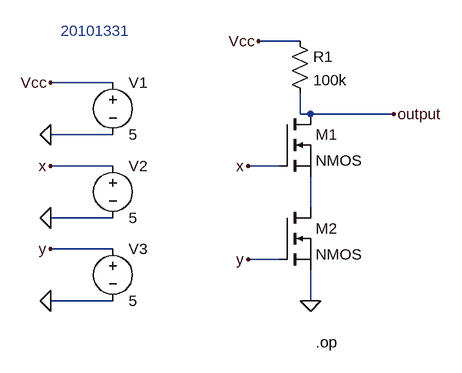
[diagram p0: schematic NAND.asc]
NAND.asc, the LTspice schematic file:
Version 4
SHEET 1 880 680
WIRE 176 -32 112 -32
WIRE -112 32 -208 32
WIRE 176 80 176 48
WIRE 192 80 176 80
WIRE 320 80 192 80
WIRE -112 112 -208 112
WIRE -112 160 -208 160
WIRE 144 160 96 160
WIRE 192 224 192 176
WIRE -112 240 -208 240
WIRE -112 288 -208 288
WIRE 144 304 96 304
WIRE -112 368 -208 368
WIRE 192 368 192 320
FLAG 192 368 0
FLAG 112 -32 Vcc
FLAG 96 160 x
FLAG 96 304 y
FLAG -208 112 0
FLAG -208 240 0
FLAG -208 368 0
FLAG -208 32 Vcc
FLAG -208 160 x
FLAG -208 288 y
FLAG 320 80 output
SYMBOL nmos 144 80 R0
SYMATTR InstName M1
SYMBOL nmos 144 224 R0
SYMATTR InstName M2
SYMBOL res 160 -48 R0
SYMATTR InstName R1
SYMATTR Value 100k
SYMBOL voltage -112 16 R0
SYMATTR InstName V1
SYMATTR Value 5
SYMBOL voltage -112 144 R0
SYMATTR InstName V2
SYMATTR Value 5
SYMBOL voltage -112 272 R0
SYMATTR InstName V3
SYMATTR Value 5
TEXT -192 -48 Left 2 ;20101331
TEXT 200 432 Left 2 !.op

The netlist it stands for:
* NAND.asc
M1 output x N001 N001 NMOS
M2 N001 y 0 0 NMOS
R1 Vcc output 100k
V1 Vcc 0 5
V2 x 0 5
V3 y 0 5
.model NMOS NMOS
.model PMOS PMOS
.lib standard.mos
* 20101331
.op
.backanno
.end